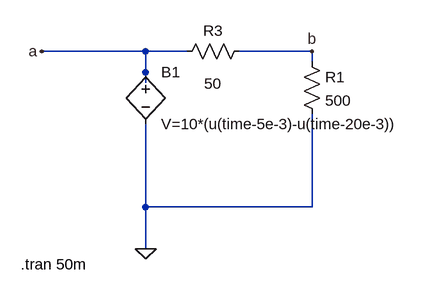
[diagram p0: schematic Circuito-Divisor-deTension.asc]
Circuito-Divisor-deTension.asc, the LTspice schematic file:
Version 4
SHEET 1 880 680
WIRE 368 -384 208 -384
WIRE 432 -384 368 -384
WIRE 624 -384 512 -384
WIRE 624 -368 624 -384
WIRE 368 -352 368 -384
WIRE 368 -336 368 -352
WIRE 368 -144 368 -272
WIRE 624 -144 624 -288
WIRE 624 -144 368 -144
WIRE 368 -80 368 -144
FLAG 368 -80 0
FLAG 208 -384 a
FLAG 624 -384 b
DATAFLAG 544 -384 ""
SYMBOL res 416 -368 R270
WINDOW 0 32 56 VTop 2
WINDOW 3 -18 56 VBottom 2
SYMATTR InstName R3
SYMATTR Value 50
SYMBOL bv 368 -368 R0
SYMATTR InstName B1
SYMATTR Value V=10*(u(time-5e-3)-u(time-20e-3))
SYMBOL res 608 -384 R0
SYMATTR InstName R1
SYMATTR Value 500
TEXT 176 -56 Left 2 !.tran 50m

The netlist it stands for:
* Circuito-Divisor-deTension.asc
R3 a b 50
B1 a 0 V=10*(u(time-5e-3)-u(time-20e-3))
R1 b 0 500
.tran 50m
.backanno
.end